# EasyEDA schematic Dogalgaz Sobasi_2020-07-29_17-51-27.json
TITLE: Sheet_1; REV: 1.0; Date: 2019-08-30; Sheet: 1/1; Drawn By: ahmetakifkaya11; Company: Tashimasu Coorp
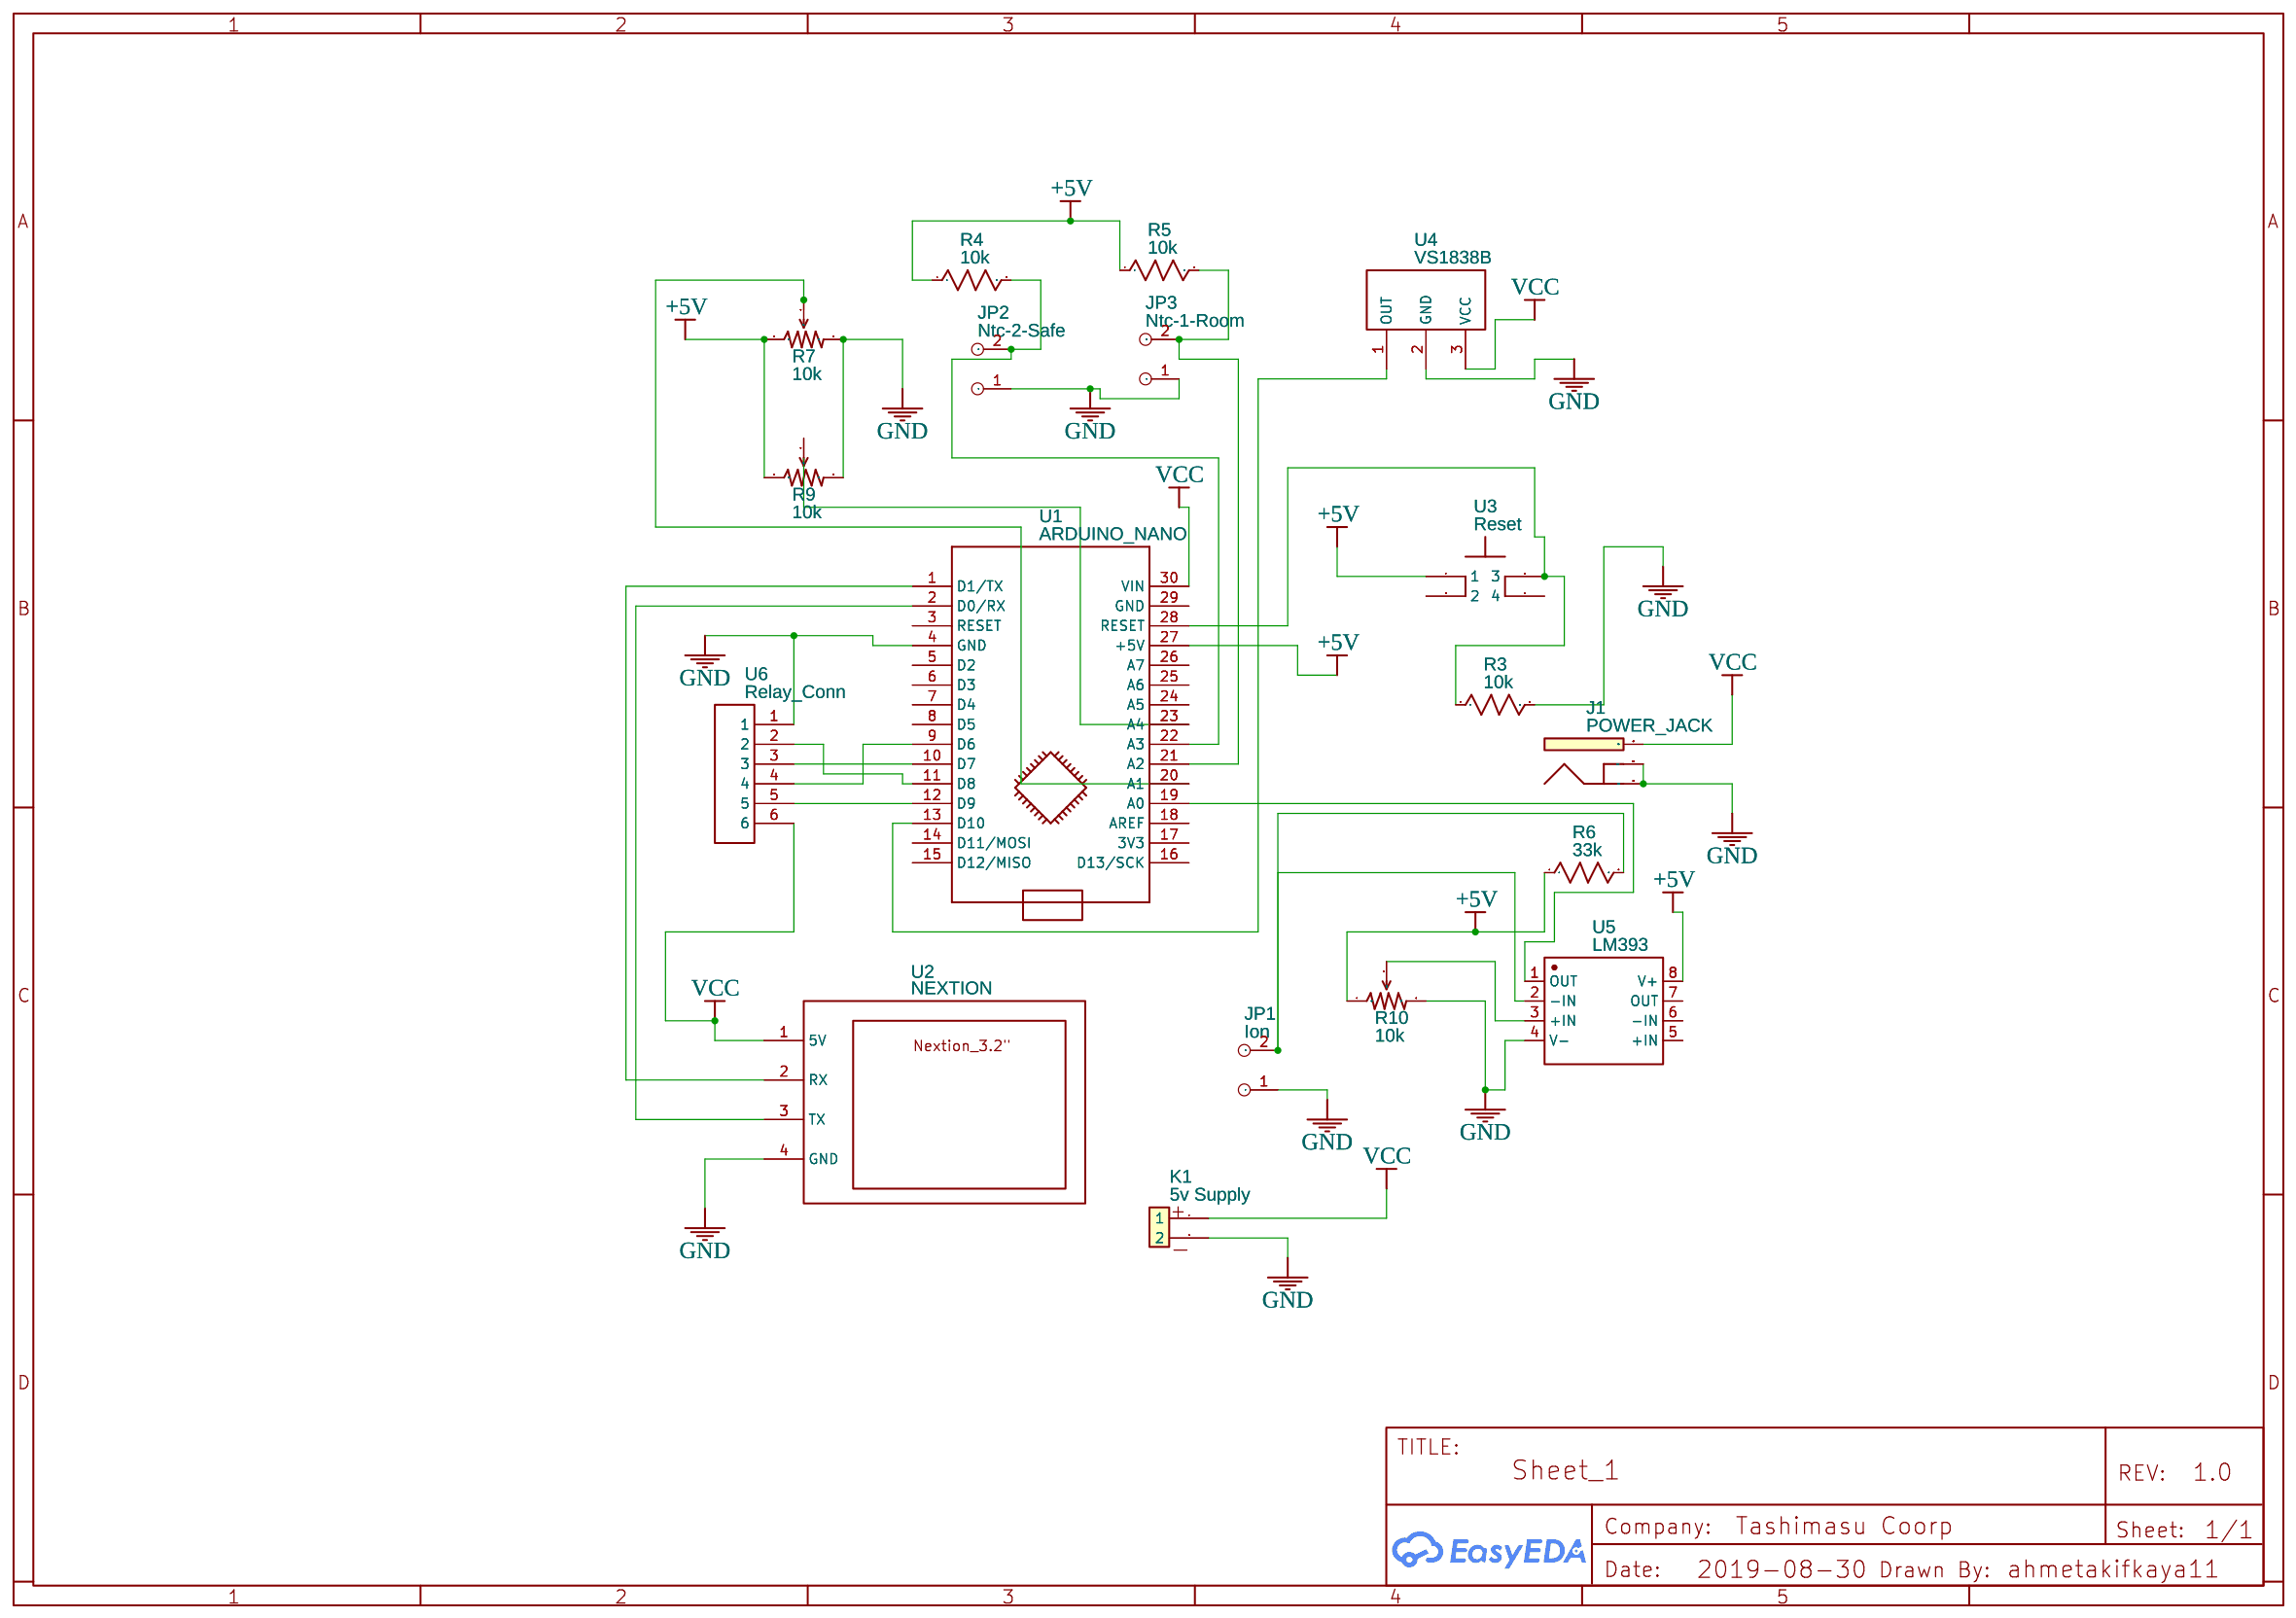
[diagram p0: schematic sheet]

## Parts
J1  POWER_JACK  [POWER_JACK_PTH]
JP1  Ion  [HDR1X2]
JP2  Ntc-2-Safe  [HDR1X2]
JP3  Ntc-1-Room  [HDR1X2]
K1  5v Supply  [2 PIN HEADER BATT]
R3  10k  [AXIAL-0.3]
R4  10k  [AXIAL-0.3]
R5  10k  [AXIAL-0.3]
R6  33k  [AXIAL-0.3]
R7  10k  [TRIM_POT_PTH]
R9  10k  [TRIM_POT_PTH]
R10  10k  [TRIM_POT_PTH]
U1  ARDUINO_NANO  [ARDUINO_NANO]
U2  NEXTION  [M1X4]
U3  Reset  [PUSH BUTTON 4 PIN DIP]
U4  VS1838B  [VS1838B]
U5  LM393  [DIP8]
U6  Relay_Conn  [6 PIN HEADER]

## Library data of the parts
J1 R7 R9 R10 = -: Contributor: SparkFun
JP1-JP3 = -: Contributor: Adafruit; sourceId: 0SMGAR9rl
K1 = -: Header, 2-Pin; sourceId: fIe8qICUc
R3-R6 = Res_AXIAL-0.3(1/8W)_US
U1 = -: sourceId: KGSeAWhDB
U2 = -: Manufacturer Part: NX3224T032; Contributor: rakowski.hub
U3 = -: Manufacturer Part: Pushbutton; Contributor: elnino; Supplier: LAMINGTON
U4 = -: Contributor: franx411
U6 = -: Contributor: M S Ali

## Nets
+5V: R4.1 R5.1 R6.1 R7.1(CCW) R9.1(CCW) R10.1(CCW) U1.27(+5V) U3.1 U5.8(V+)
GND: J1.GND J1.GNDBREAK JP1.1 JP2.1 JP3.1 K1.2 R3.2 R7.3(CW) R9.3(CW) R10.3(CW) U1.4(GND) U2.4(GND) U4.2(GND) U5.4(V-) U6.1
VCC: J1.PWR K1.1 U1.30(VIN) U2.1(5V) U4.3(VCC) U6.6
Net-(JP1-2): JP1.2 R6.2 U5.2(-IN)
Net-(JP2-2): JP2.2 R4.2 U1.22(A3)
Net-(JP3-2): JP3.2 R5.2 U1.21(A2)
Net-(R3-1): R3.1 U1.28(RESET) U3.3
Net-(R7-2): R7.2(WIPER) U1.20(A1)
Net-(R9-2): R9.2(WIPER) U1.23(A4)
Net-(R10-2): R10.2(WIPER) U5.3(+IN)
Net-(U1-1): U1.1(D1/TX) U2.2(RX)
Net-(U1-2): U1.2(D0/RX) U2.3(TX)
Net-(U1-9): U1.9(D6) U6.4
Net-(U1-10): U1.10(D7) U6.3
Net-(U1-11): U1.11(D8) U6.2
Net-(U1-12): U1.12(D9) U6.5
Net-(U1-13): U1.13(D10) U4.1(OUT)
Net-(U1-19): U1.19(A0) U5.1(OUT)

Not connected (* = marked no-connect by the designer): U1 3(RESET) 5(D2) 6(D3) 7(D4) 8(D5) 14(D11/MOSI) 15(D12/MISO) 16(D13/SCK) 17(3V3) 18(AREF) 24(A5) 25(A6) 26(A7) 29(GND); U3 2 4; U5 5(+IN) 6(-IN) 7(OUT)
